# Altium schematic sheet IsoPowerSupply.SchDoc
size A4; SheetNumber: 2; SheetTotal: 3; Schematic: Power Supply
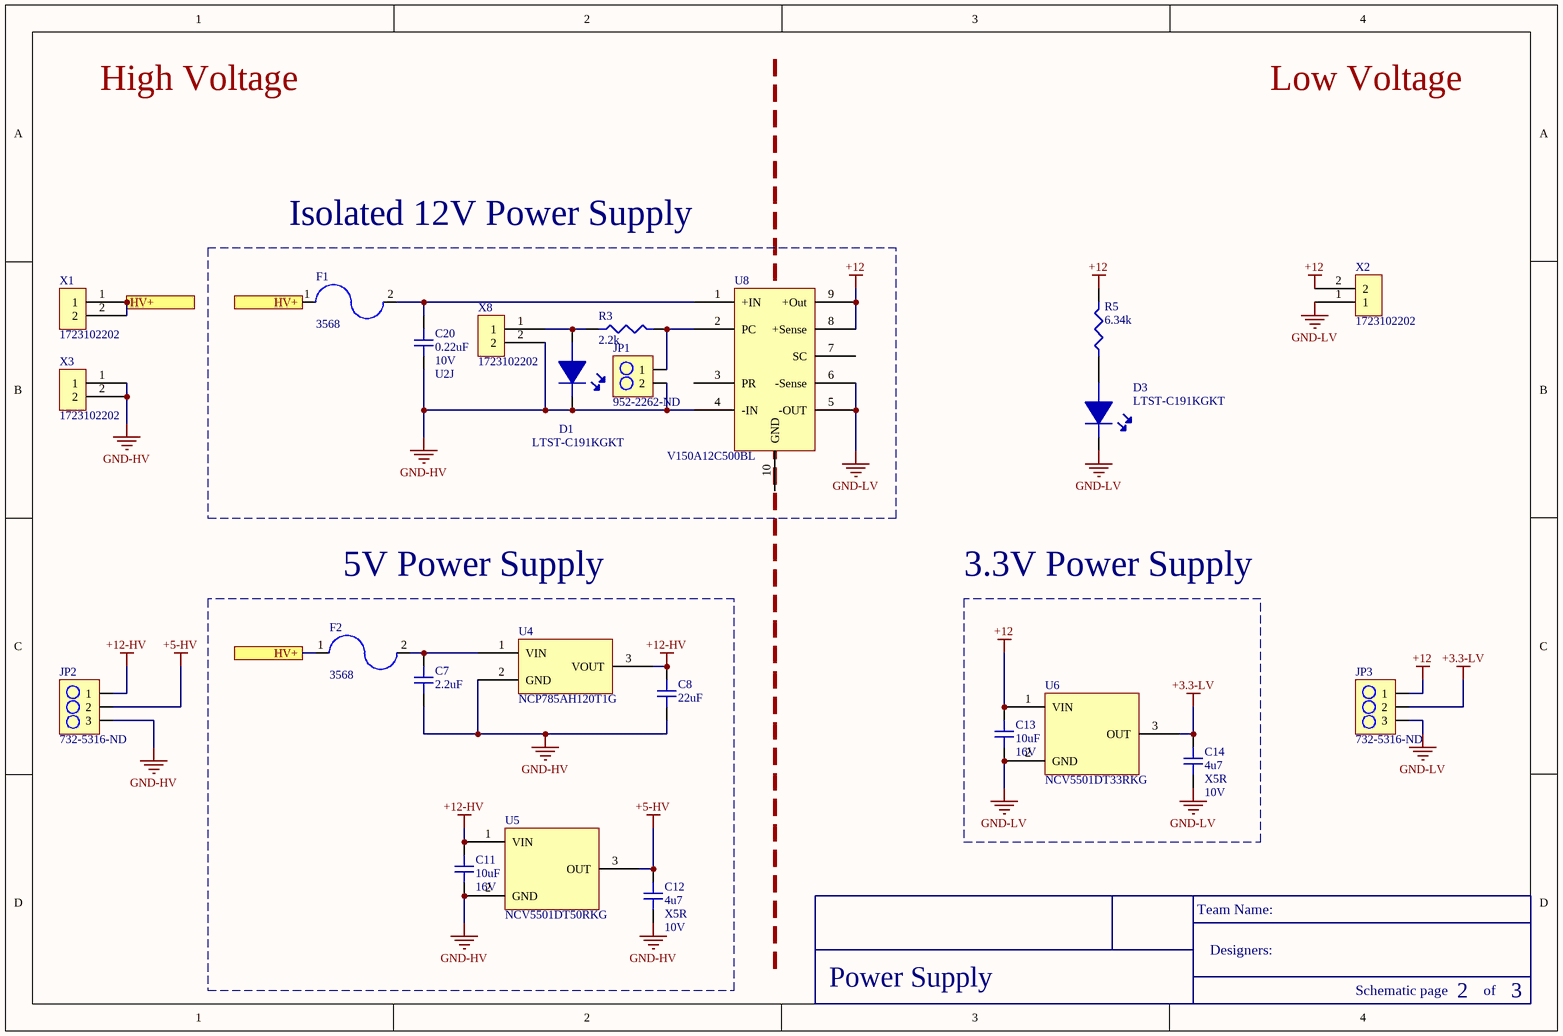
[diagram p0: IsoPowerSupply.SchDoc]

## Parts
C7  2.2uF  [Cap-2.2u- ECW-FD2W225J4]
C8  22uF  [C1206]
C11  10uF  Voltage Rating: 16V  [C0805]
C12  4u7  Dielectric: X5R  Voltage: 10V  [C0805]
C13  10uF  Voltage Rating: 16V  [C0805]
C14  4u7  Dielectric: X5R  Voltage: 10V  [C0805]
C20  0.22uF  Voltage Rating: 10V  Dielectric: U2J  [Cap-0.22-SK057C224KAR]
D1  LTST-C191KGKT  [LED_0603]
D3  LTST-C191KGKT  [LED_0603]
F1  3568  [FUSE_MINI_HOLDER]
F2  3568  [FUSE_MINI_HOLDER]
JP1  952-2262-ND  [2PIN_HEADER]
JP2  732-5316-ND  [3PIN_HEADER]
JP3  732-5316-ND  [3PIN_HEADER]
R3  2.2k  [R0805]
R5  6.34k  [R0805]
U4  NCP785AH120T1G  [NCP785AH120T1G]
U5  NCV5501DT50RKG  [NCV5501DT50RKG]
U6  NCV5501DT33RKG  [NCV5501DT50RKG]
U8  V150A12C500BL  [Vicor-V150A12C500BL]
X1  1723102202  [Molex2Pin]
X2  1723102202  [Molex2Pin]
X3  1723102202  [Molex2Pin]
X8  1723102202  [Molex2Pin]

## Blocks framed on the sheet
Isolated 12V Power Supply: C20 D1 F1 JP1 R3 U8 X8
5V Power Supply: C7 C8 C11 C12 F2 U4 U5
3.3V Power Supply: C13 C14 U6

## Ports
HV+

## Nets
+3.3-LV: C14.2 JP3.2 U6.3(OUT)
+5-HV: C12.2 JP2.2 U5.3(OUT)
+12: C13.2 JP3.1 R5.2 U6.1(VIN) U8.8(+Sense) U8.9(+Out) X2.2
+12-HV: C8.2 C11.2 JP2.1 U4.3(VOUT) U5.1(VIN)
GND-HV: C7.1 C8.1 C11.1 C12.1 C20.1 D1.2 JP1.2 JP2.3 U4.2(GND) U5.2(GND) U8.4(-IN) X3.1 X3.2 X8.2
GND-LV: C13.1 C14.1 D3.2 JP3.3 U6.2(GND) U8.5(-OUT) U8.6(-Sense) X2.1
HV+: F1.1 F2.1 X1.1 X1.2 ; port HV+
NetC7_2: C7.2 F2.2 U4.1(VIN)
NetC20_2: C20.2 F1.2 U8.1(+IN)
NetD1_1: D1.1 R3.1 X8.1
NetD3_1: D3.1 R5.1
NetJP1_1: JP1.1 R3.2 U8.2(PC)

Not connected (* = marked no-connect by the designer): U8 3(PR) 7(SC) 10(GND)

## Notes on the sheet
- High Voltage
- Low Voltage
- Team Name:
- Designers:
- Schematic page
- of

## Library data of the parts
C7 = ECW-FD2W225J4: CAP FILM 2.2UF 5% 450VDC RADIAL; Manufacturer: Panasonic; Supplier 1: Digi-Key; Manufacurer Part number: ECW-FD2W225J4
C8 = GCM32ER71C226KE19L: CAP CER 22UF 16V X7R 1210; Manufacturer: Murata; Manufacturer Part Number: GCM31CR71A226KE02L; Supplier 1: Digi-Key
C11 C13 = CL21B106KOQNNNG: CAP CER 10UF 16V X7R 0805; Manufacturer: Samsung; OP Temp Range: -55-125; Tolerance: 10%; Package: 0805; Capacitance: 10uF; Supplier 1: Digi-Key; Temp Coef: X7R; Supplier Part Number 1: 1276-6472-2-ND
C12 C14 = GRM219R61A475KE34D: CAP MLCC 4.7µF ±10% 10V X5R Ceramic Capacitor -55°C ~ 85°C Surface Mount, MLCC 0805 (2012 Metric) 0.079" L x 0.049" W (2.00mm x 1.25mm); Manufacturer: Murata; Capacitance: 4.7uF; Supplier 1: Digi-Key; Manufacturer Part Number: GRM219R61A475KE34D; Stock 1: 251830; Pricing 1: 1=0.21, 10=0.152, 100=0.0716, 500=0.0502, 1000=0.0416 (USD); Mount: Surface Mount; Case/Package: 0805; Case Code (Metric): 2012; Case Code (Imperial): 0805; Min Operating Temperature: -55°C; Max Operating Temperature: 85°C; Packaging: Tape and Reel; Tolerance: 10%; Package Quantity: 4000; Voltage Rating: 10V; Voltage Rating (DC): 10V; Termination: SMD/SMT; Length: 2mm; Height: 0.85mm; Width: 0.049inch; Thickness: 0.037inch; Depth: 1.25mm; Lead Free: Lead Free; ComponentLink1URL: https://datasheet.ciiva.com/169/product-169527.pdf; ComponentLink1Description: https://datasheet.ciiva.com/169/product-169527.pdf; ComponentLink2URL: https://datasheet.ciiva.com/5414/product-5414984.pdf; ComponentLink2Description: https://datasheet.ciiva.com/5414/product-5414984.pdf; ComponentLink3URL: https://datasheet.ciiva.com/16467/product-16467258.pdf; ComponentLink3Description: https://datasheet.ciiva.com/16467/product-16467258.pdf; ComponentLink4URL: https://datasheet.ciiva.com/29542/product-29542667.pdf; ComponentLink4Description: https://datasheet.ciiva.com/29542/product-29542667.pdf; ComponentLink5URL: https://datasheet.ciiva.com/29542/product-29542668.pdf; ComponentLink5Description: https://datasheet.ciiva.com/29542/product-29542668.pdf; Supplier Part Number 1: 490-3339-6-ND
C20 = SK057C224KAR: CAP CER 0.22UF 500V X7R RADIAL; Manufacturer: AVX Corporation; Capacitance: 100nF; Tolerance: 5%; Supplier 1: Digi-Key; Manufacturer Part Number: SK057C224KAR; Stock 1: 6000; Pricing 1: 1=0.46, 10=0.32, 100=0.192, 500=0.144, 1000=0.1216 (USD); Mount: Surface Mount; Case/Package: 0805; Case Code (Imperial): 0805; Case Code (Metric): 2012; Min Operating Temperature: -55°C; Max Operating Temperature: 125°C; Voltage Rating (DC): 10V; Packaging: Tape and Reel; Package Quantity: 3000; Termination: SMD/SMT; Length: 2mm; Height: 1.25mm; Width: 0.049inch; Thickness: 0.053inch; Depth: 1.25mm; Radiation Hardening: No; ComponentLink1URL: https://datasheet.ciiva.com/5424/product-5424660.pdf; ComponentLink1Description: https://datasheet.ciiva.com/5424/product-5424660.pdf; ComponentLink2URL: https://datasheet.ciiva.com/17451/product-17451845.pdf; ComponentLink2Description: https://datasheet.ciiva.com/17451/product-17451845.pdf; ComponentLink3URL: https://datasheet.ciiva.com/11618/product-11618924.pdf; ComponentLink3Description: https://datasheet.ciiva.com/11618/product-11618924.pdf; Supplier Part Number 1: 490-11592-6-ND
D1 D3 = LTST-C191KGKT: LED GREEN CLEAR 0603 SMD; Manufacturer: Vishay Lite-On; Lens Colour: Clear,Colorless; Power Rating: 75mW; Luminous Intensity: 35mcd; Viewing Angle: 130°; Lens Style: Clear,Diffused,Colorless,Rectangular; Forward Current: 30mA; Forward Voltage: 2V; Dominant Wavelength: 571nm; Test Current: 20mA; Number of Elements: 1; Wavelength: 574nm; Supplier 1: Digi-Key; Manufacturer Part Number: LTST-C191KGKT; Stock 1: 1301664; Pricing 1: 1=0.29, 10=0.211, 25=0.1556, 100=0.1111, 250=0.0756, 500=0.0667, 1000=0.0522, 2500=0.0511 (USD); Mount: Surface Mount; Case/Package: 0603; Number of Pins: 2; Colour: Green; Case Code (Metric): 1608; Case Code (Imperial): 0603; Min Operating Temperature: -55°C; Max Operating Temperature: 85°C; Packaging: Tape and Reel; Package Quantity: 1; Illumination Colour: Green; Lens Transparency: Clear; Power Dissipation: 75mW; Number of LEDs: 1; Length: 1.6mm; Height: 0.55mm; Width: 0.8mm; Depth: 0.8mm; Radiation Hardening: No; Lead Free: Lead Free; ComponentLink1URL: https://datasheet.ciiva.com/12400/100-ltst-c191kgkt-53586-12400818.pdf; ComponentLink1Description: https://datasheet.ciiva.com/12400/100-ltst-c191kgkt-53586-12400818.pdf; ComponentLink2URL: https://datasheet.ciiva.com/2109/s-110-ltst-c191kgkt-2109973.pdf; ComponentLink2Description: https://datasheet.ciiva.com/2109/s-110-ltst-c191kgkt-2109973.pdf; ComponentLink3URL: https://datasheet.ciiva.com/2109/s-110-ltst-c191kgkt-2109974.pdf; ComponentLink3Description: https://datasheet.ciiva.com/2109/s-110-ltst-c191kgkt-2109974.pdf; ComponentLink4URL: https://datasheet.ciiva.com/2109/s-110-ltst-c191kgkt-2109975.pdf; ComponentLink4Description: https://datasheet.ciiva.com/2109/s-110-ltst-c191kgkt-2109975.pdf; ComponentLink5URL: https://datasheet.ciiva.com/15223/getdatasheetpartid-103913-15223276.pdf; ComponentLink5Description: https://datasheet.ciiva.com/15223/getdatasheetpartid-103913-15223276.pdf; ComponentLink6URL: https://datasheet.ciiva.com/11773/0900766b80dc02b1-11773629.pdf; ComponentLink6Description: https://datasheet.ciiva.com/11773/0900766b80dc02b1-11773629.pdf; ComponentLink7URL: https://datasheet.ciiva.com/16215/ltst-c191kgkt-16215151.pdf; ComponentLink7Description: https://datasheet.ciiva.com/16215/ltst-c191kgkt-16215151.pdf; Supplier Part Number 1: 160-1446-6-ND
F1 F2 = 3568: FUSE HOLDER MINI AUTO PC; Manufacturer: Keystone Electronics; Colour: Black; Material: Brass,Nickel,Tin,Nylon; Body Material: Nylon; Current Rating: 20A; Voltage Rating (AC): 500V; Number of Poles: 1; Illumination Type: Illuminated; Fuse Type: Automotive; Approvals: UL; Supplier 1: Digi-Key; Manufacturer Part Number: 3568; Stock 1: 69840; Pricing 1: 1=0.98, 10=0.853, 50=0.7694, 100=0.7359, 250=0.669, 1000=0.599, 2500=0.502, 5000=0.4683 (USD); Mount: Vertical,PCB; Contact Material: Brass,Nickel,Tin; Contact Plating: Tin; Min Operating Temperature: -50°C; Max Operating Temperature: 145°C; Package Quantity: 1; Number of Circuits: 1; Voltage: 500V; Termination: PC Pin; Fuse Current: 20A; Orientation: Vertical; Length: 16mm; Depth: 6.73mm; REACH SVHC: No SVHC; Lead Free: Lead Free; Flammability Rating: UL94 V-0; ComponentLink1URL: https://datasheet.ciiva.com/16294/m60-2p40-16294706.pdf; ComponentLink1Description: https://datasheet.ciiva.com/16294/m60-2p40-16294706.pdf; ComponentLink2URL: https://datasheet.ciiva.com/16874/70182101-16874378.pdf; ComponentLink2Description: https://datasheet.ciiva.com/16874/70182101-16874378.pdf; Supplier Part Number 1: 36-3568-ND
JP1 = M20-9990246: CONN_HeaderPins2pos Headers & Wire Housings 02 SIL VERTICAL PIN HEADER TIN; Manufacturer: Harwin; Contact Resistance: 30mR; Max Current Rating: 3A; Number of Positions: 2; Gender: Male; Connector Type: Male Pin; Insulation Resistance: 10GR; Voltage Rating (AC): 750V; Pitch: 2.54mm; Supplier 1: Digi-Key; Manufacturer Part Number: M20-9990246; Stock 1: 53577; Pricing 1: 1=0.11, 10=0.099, 100=0.0609, 500=0.0504, 1000=0.0441, 5000=0.0378, 10000=0.0368 (USD); Case/Package: SIL; Colour: Black; Housing Colour: Black; Housing Material: Nylon; Contact Plating: Tin; Contact Material: Bronze,Brass; Min Operating Temperature: -40°C; Max Operating Temperature: 105°C; Package Quantity: 1000; Packaging: Bulk; Termination: Solder; Number of Rows: 1; Number of Contacts: 2; Orientation: Straight; Current Rating: 3A; Length: 5.08mm; Depth: 2.54mm; Contact Mating Length: 0.24inch; Radiation Hardening: No; REACH SVHC: No SVHC; ComponentLink1URL: https://datasheet.ciiva.com/8046/315376-8046930.pdf; ComponentLink1Description: https://datasheet.ciiva.com/8046/315376-8046930.pdf; ComponentLink2URL: https://datasheet.ciiva.com/6833/m20-999-6833368.pdf; ComponentLink2Description: https://datasheet.ciiva.com/6833/m20-999-6833368.pdf; ComponentLink3URL: https://datasheet.ciiva.com/11745/0900766b81034e61-11745755.pdf; ComponentLink3Description: https://datasheet.ciiva.com/11745/0900766b81034e61-11745755.pdf; ComponentLink4URL: https://datasheet.ciiva.com/22660/1830818-22660571.pdf; ComponentLink4Description: https://datasheet.ciiva.com/22660/1830818-22660571.pdf; ComponentLink5URL: https://datasheet.ciiva.com/26852/getdatasheetpartid-384170-26852203.pdf; ComponentLink5Description: https://datasheet.ciiva.com/26852/getdatasheetpartid-384170-26852203.pdf; Supplier Part Number 1: 952-2262-ND
JP2 JP3 = 61300311121: CONN_HeaderPins3pos WURTH ELEKTRONIK Board-To-Board Connector, Vertical, WR-PHD Series, Through Hole, Header, 3 Contacts, 2.54 mm; Manufacturer: Wurth Electronics; Number of Positions: 3; Gender: Male; Connector Type: Male Pin; Pitch: 0.1inch; Supplier 1: Digi-Key; Manufacturer Part Number: 61300311121; Stock 1: 57026; Pricing 1: 1=0.13, 10=0.106, 25=0.088, 50=0.074, 100=0.067, 1000=0.061 (USD); Mount: Through Hole; Case/Package: 100; Contact Plating: Gold; Contact Material: Copper; Colour: Black; Number of Rows: 1; Packaging: Bulk; Termination: Solder; Number of Contacts: 3; Contact Mating Length: 0.236inch; REACH SVHC: Unknown; Lead Free: Lead Free; ComponentLink1URL: http://www.farnell.com/cad/1737268.pdf; ComponentLink1Description: http://www.farnell.com/cad/1737268.pdf; Supplier Part Number 1: 732-5316-ND
R3 = RC0805JR-072K2L: RES SMD 2.2K OHM 5% 1/8W; Manufacturer: Yageo; Resistance: 2.2kR; Temperature Coefficient: 100ppm/°C; Power Rating: 125mW; Voltage Rating: 150V; Supplier 1: Digi-Key; Manufacturer Part Number: RC0805JR-072K2L; Stock 1: 810523; Pricing 1: 1=0.1, 10=0.019, 100=0.0076, 1000=0.0034, 2500=0.003 (USD); Case/Package: 0805; Contact Plating: Tin,Lead,Matte; Case Code (Imperial): 0805; Case Code (Metric): 2012; Min Operating Temperature: -55°C; Max Operating Temperature: 155°C; Tolerance: 5%; Packaging: Tape and Reel; Composition: Thick Film; Termination: SMD/SMT; Military Standard: Not; Length: 2mm; Depth: 1.25mm; Radiation Hardening: No; REACH SVHC: Unknown; Lead Free: Lead Free; ComponentLink1URL: https://datasheet.ciiva.com/12667/rc0805-12667397.pdf; ComponentLink1Description: https://datasheet.ciiva.com/12667/rc0805-12667397.pdf; ComponentLink2URL: https://datasheet.ciiva.com/15190/getdatasheetpartid-251869-15190044.pdf; ComponentLink2Description: https://datasheet.ciiva.com/15190/getdatasheetpartid-251869-15190044.pdf; ComponentLink3URL: https://datasheet.ciiva.com/7941/442941-7941935.pdf; ComponentLink3Description: https://datasheet.ciiva.com/7941/442941-7941935.pdf; Supplier Part Number 1: 311-2.2KARCT-ND
R5 = ERJ-6ENF6341V: RES SMD 6.34K OHM 1% 1/8W 0805; Manufacturer: Panasonic; Supplier 1: Digi-Key; Manufacturer Part Number: ERJ-6ENF6341V
U4 = NCP785AH120T1G: IC REG LINEAR 12V 10MA SOT89-3; Manufacturer: On Semiconductor; Supplier 1: Digi-Key; Manufacturer Part Number: NCP785AH120T1G
U5 = NCV5501DT50RKG: IC REG LINEAR 5V 500MA DPAK; Manufacturer: On Semiconductor; Manufacturer Part Number: NCP785AH120T1G; Supplier 1: Digi-Key
U6 = NCV5501DT33RKG: IC REG LINEAR 3.3V 500MA DPAK; Manufacturer: On Semiconductor; Supplier 1: Digi-Key; Manufacturer Part Number: NCV5501DT33RKG
U8 = V150A12C500BL: Isolated DC/DC Converters C 100/200/150 12v/ 41.7A; Manufacturer: On Semiconductor; Manufacturer Part Number: NCP785AH120T1G; Supplier 1: Digi-Key
X1-X3 X8 = 1723102202: CONN HEADER R/A 2POS 3.5MM; Manufacturer: Molex; Supplier 1: Digi-Key; Manufacturer Part Number: 1723102202